# Altium schematic sheet Sheet3.SCHDOC
size 840 x 594 mm; SheetNumber: 3; SheetTotal: 5; DocumentName: Sheet3.SCHDOC
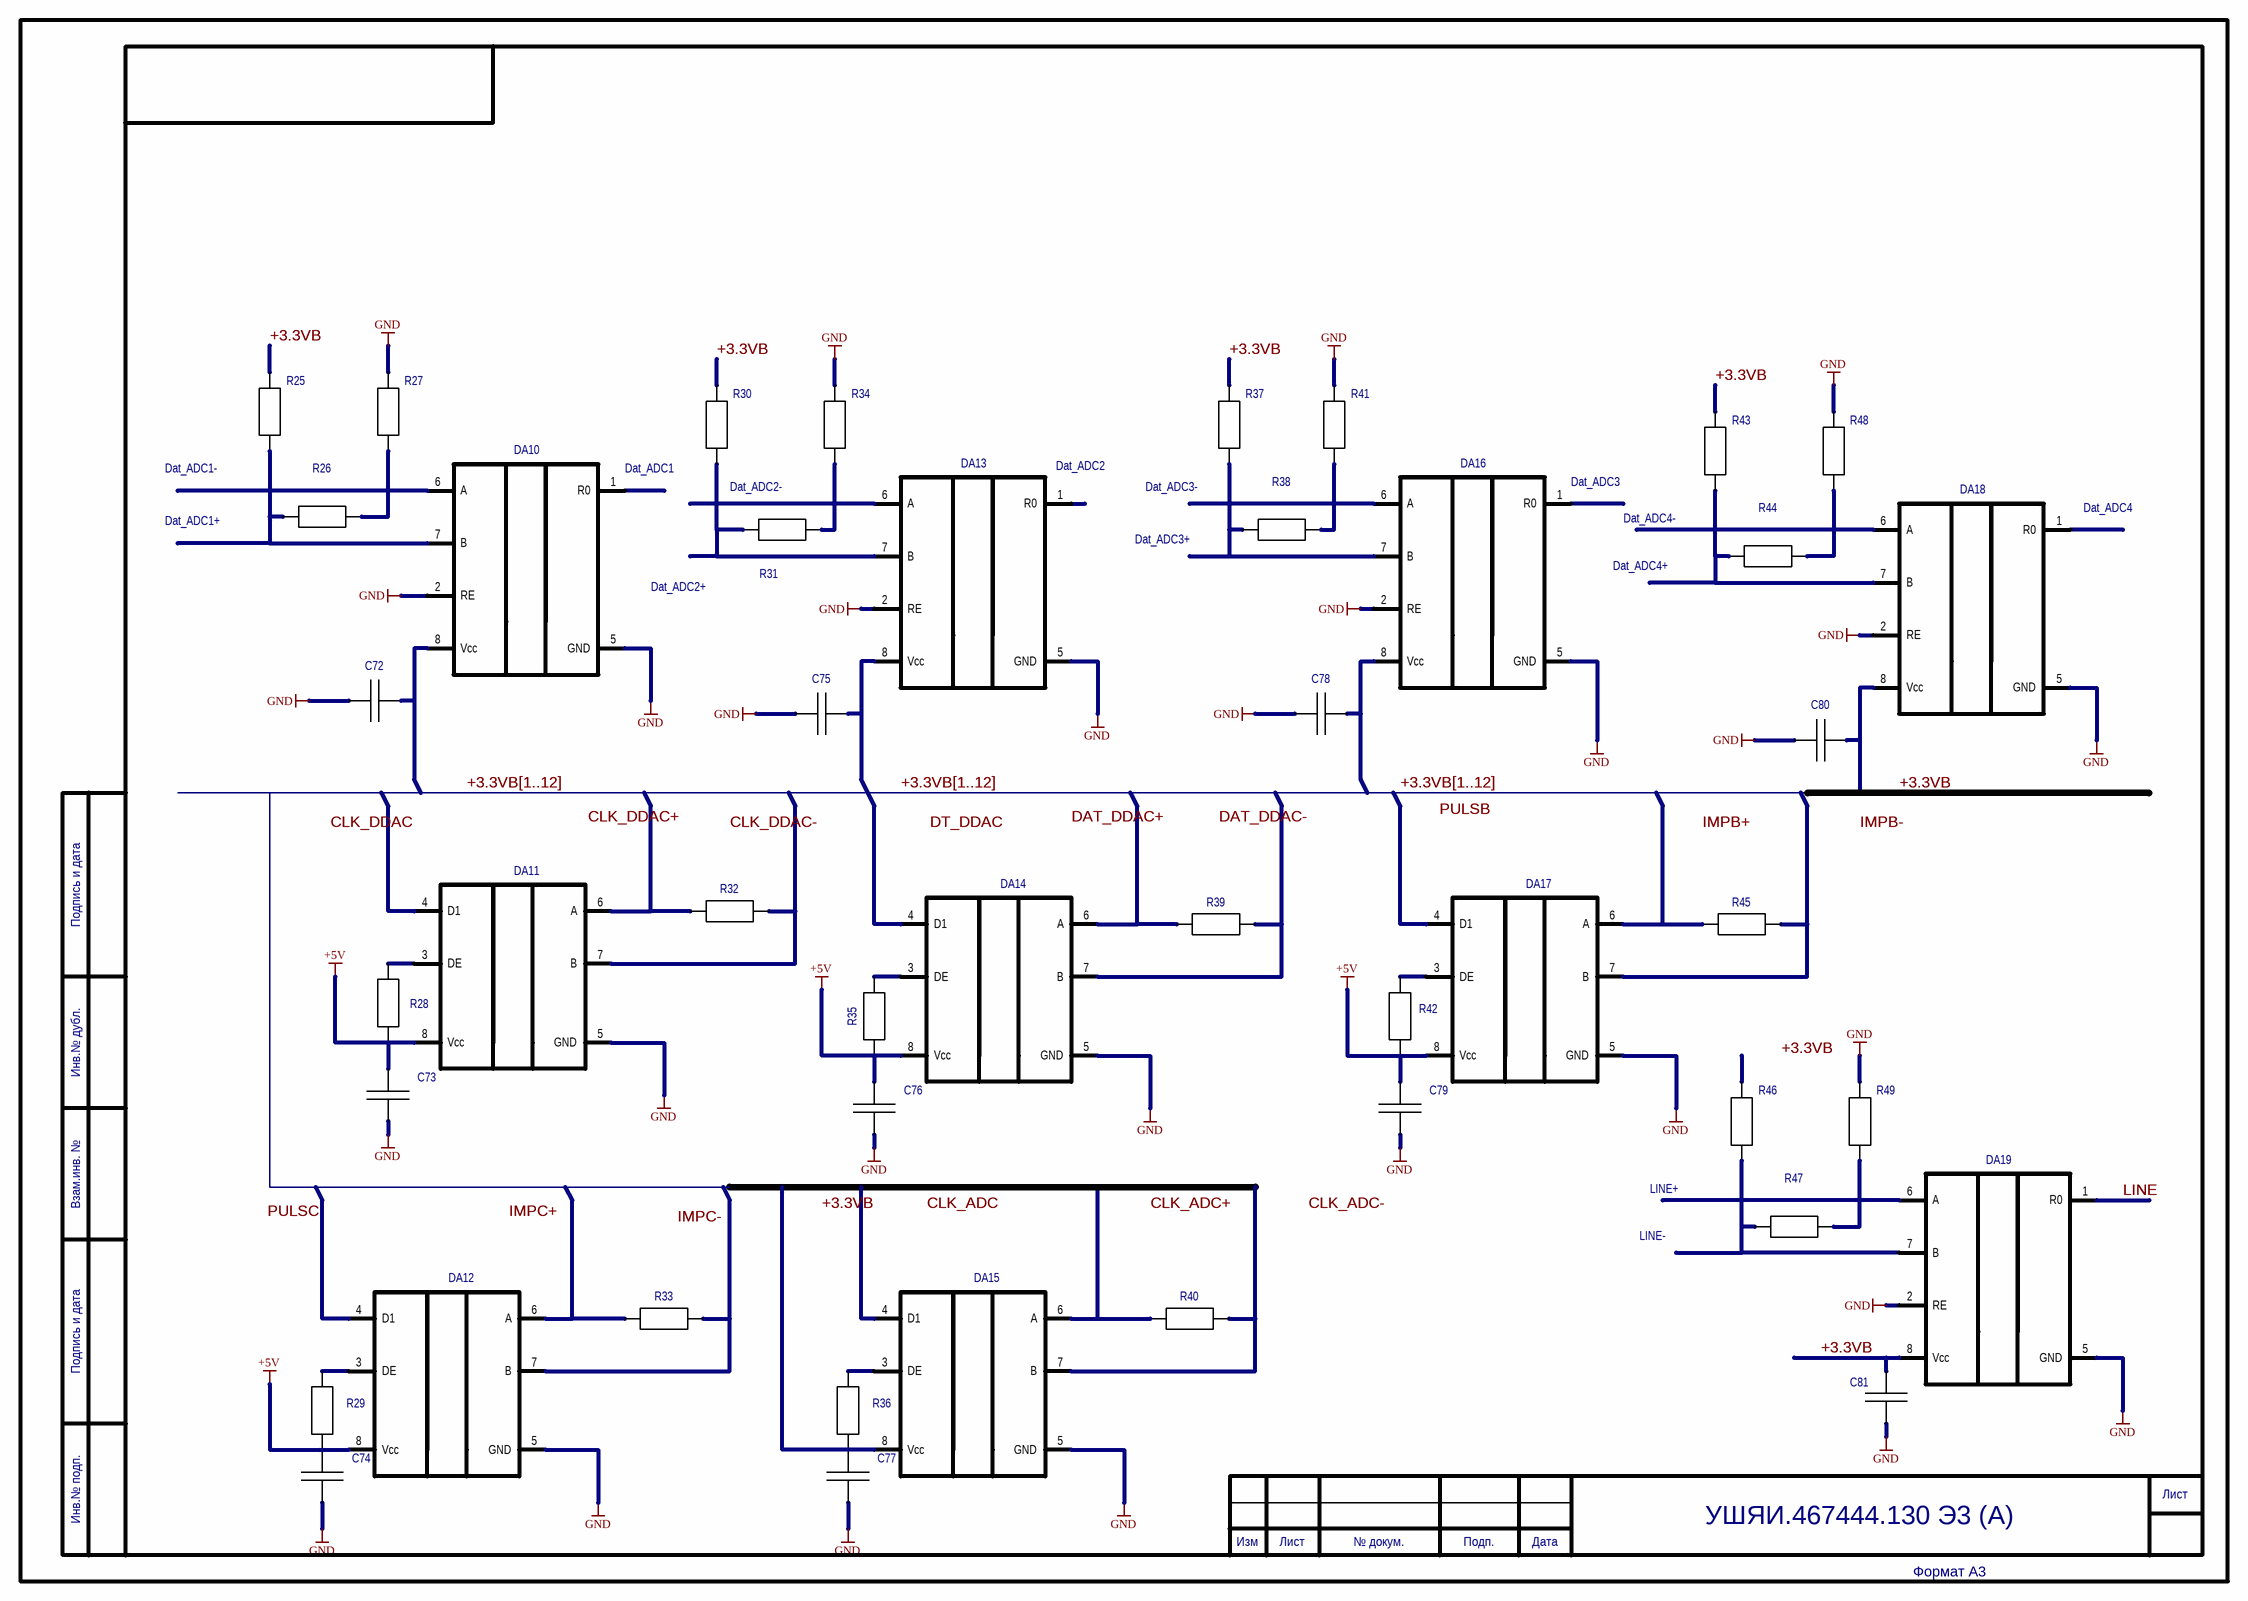
[diagram p0: Sheet3.SCHDOC]

## Parts
C72  GRM21BR71H105K  (value not drawn)
C73  GRM21BR71H104KA01L  (value not drawn)
C74  GRM21BR71H104KA01L  (value not drawn)
C75  GRM21BR71H105K  (value not drawn)
C76  GRM21BR71H104KA01L  (value not drawn)
C77  GRM21BR71H104KA01L  (value not drawn)
C78  GRM21BR71H105K  (value not drawn)
C79  GRM21BR71H104KA01L  (value not drawn)
C80  GRM21BR71H105K  (value not drawn)
C81  GRM21BR71H105K  (value not drawn)
DA10  SN65HVD75  (value not drawn)
DA11  ADM483  (value not drawn)
DA12  ADM483  (value not drawn)
DA13  SN65HVD75  (value not drawn)
DA14  ADM483  (value not drawn)
DA15  SN65HVD75-A  (value not drawn)
DA16  SN65HVD75  (value not drawn)
DA17  ADM483  (value not drawn)
DA18  SN65HVD75  (value not drawn)
DA19  SN65HVD75  (value not drawn)
R25  1206-1 КОМ+-5%  (value not drawn)
R26  1206 - 100 ОМ+-5%  (value not drawn)
R27  1206-1 КОМ+-5%  (value not drawn)
R28  0805-10 KОМ+-5%  [0805]  (value not drawn)
R29  0805-10 KОМ+-5%  [0805]  (value not drawn)
R30  1206-1 КОМ+-5%  (value not drawn)
R31  1206 - 100 ОМ+-5%  (value not drawn)
R32  0805-10 KОМ+-5%  [0805]  (value not drawn)
R33  0805-10 KОМ+-5%  [0805]  (value not drawn)
R34  1206-1 КОМ+-5%  (value not drawn)
R35  0805-10 KОМ+-5%  [0805]  (value not drawn)
R36  0805-10 KОМ+-5%  [0805]  (value not drawn)
R37  1206-1 КОМ+-5%  (value not drawn)
R38  1206 - 100 ОМ+-5%  (value not drawn)
R39  0805-10 KОМ+-5%  [0805]  (value not drawn)
R40  0805-10 KОМ+-5%  [0805]  (value not drawn)
R41  1206-1 КОМ+-5%  (value not drawn)
R42  0805-10 KОМ+-5%  [0805]  (value not drawn)
R43  1206-1 КОМ+-5%  (value not drawn)
R44  1206 - 100 ОМ+-5%  (value not drawn)
R45  0805-10 KОМ+-5%  [0805]  (value not drawn)
R46  1206-1 КОМ+-5%  (value not drawn)
R47  1206 - 100 ОМ+-5%  (value not drawn)
R48  1206-1 КОМ+-5%  (value not drawn)
R49  1206-1 КОМ+-5%  (value not drawn)

## Nets
+5V: C73.2 C74.2 C76.2 C79.2 DA11.8(Vcc) DA12.8(Vcc) DA14.8(Vcc) DA17.8(Vcc) R28.1 R29.1 R35.1 R42.1
GND: C72.1 C73.1 C74.1 C75.1 C76.1 C77.1 C78.1 C79.1 C80.1 C81.1 DA10.2(RE) DA10.5(GND) DA11.5(GND) DA12.5(GND) DA13.2(RE) DA13.5(GND) DA14.5(GND) DA15.5(GND) DA16.2(RE) DA16.5(GND) DA17.5(GND) DA18.2(RE) DA18.5(GND) DA19.2(RE) DA19.5(GND) R27.2 R34.2 R41.2 R48.2 R49.2
+3.3VB: C81.2 DA19.8(Vcc) R25.2 R30.2 R37.2 R43.2
LINE: DA19.1(R0)
NetC72_2: C72.2 DA10.8(Vcc)
NetC75_2: C75.2 DA13.8(Vcc)
NetC77_2: C77.2 DA15.8(Vcc) R36.1
NetC78_2: C78.2 DA16.8(Vcc)
NetC80_2: C80.2 DA18.8(Vcc)
NetDA10_6: DA10.6(A) R26.2 R27.1
NetDA10_7: DA10.7(B) R25.1 R26.1
NetDA11_3: DA11.3(DE) R28.2
NetDA11_6: DA11.6(A) R32.1
NetDA11_7: DA11.7(B) R32.2
NetDA12_3: DA12.3(DE) R29.2
NetDA12_6: DA12.6(A) R33.1
NetDA12_7: DA12.7(B) R33.2
NetDA13_6: DA13.6(A) R31.2 R34.1
NetDA13_7: DA13.7(B) R30.1 R31.1
NetDA14_3: DA14.3(DE) R35.2
NetDA14_6: DA14.6(A) R39.1
NetDA14_7: DA14.7(B) R39.2
NetDA15_3: DA15.3(DE) R36.2
NetDA15_6: DA15.6(A) R40.1
NetDA15_7: DA15.7(B) R40.2
NetDA16_6: DA16.6(A) R38.2 R41.1
NetDA16_7: DA16.7(B) R37.1 R38.1
NetDA17_3: DA17.3(DE) R42.2
NetDA17_6: DA17.6(A) R45.1
NetDA17_7: DA17.7(B) R45.2
NetDA18_6: DA18.6(A) R44.2 R48.1
NetDA18_7: DA18.7(B) R43.1 R44.1
NetDA19_6: DA19.6(A) R47.2 R49.1
NetDA19_7: DA19.7(B) R46.1 R47.1

Not connected (* = marked no-connect by the designer): DA10 1(R0); DA11 4(D1); DA12 4(D1); DA13 1(R0); DA14 4(D1); DA15 4(D1); DA16 1(R0); DA17 4(D1); DA18 1(R0); R46 2

## Buses and harness runs
bus +3.3VB[1..12]

## Notes on the sheet
- (near R25) Dat_ADC1-
- Dat_ADC1
- Dat_ADC2-
- (near DA13) Dat_ADC2
- Dat_ADC3-
- (near DA16) Dat_ADC3
- (near DA18) Dat_ADC4
- Dat_ADC1+
- Dat_ADC3+
- Dat_ADC4+
- Dat_ADC4-
- Dat_ADC2+
- Подпись и дата
- Инв.№ дубл.
- Взам.инв. №
- LINE-
- LINE+
- Инв.№ подп.
- УШЯИ.467444.130 Э3 (A)
- Лист
- Изм
- № докум.
- Подп.
- Дата
- Формат А3
- Подп. дата
- Инв. № дубл.
- Взам. инв. №
- Подп. и дата
- Инв. № подл.
- Изм.
- ALTIUM GOSTBOM2.0 KEV
- Файл:
- Копировал

## Library data of the parts
C72 C75 C78 C80 C81 = GRM21BR71H105K: Name2: Конденсатор GRM21BR71H105K; Name1: Конденсатор GRM21BR71H105K Murata; Value: *
C73 C74 C76 C77 C79 = GRM21BR71H104KA01L: Name2: Конденсатор GRM21BR71H104KA01L; Value: *; Name1: Конденсатор GRM21BR71H104KA01L
DA10 DA13 DA16 DA18 DA19 = SN65HVD75: Standart: Analog Devices; Name2: ADM483AR; Value: *; Name1: ADM483AR
DA11 DA12 DA14 DA17 = ADM483: Standart: Analog Devices; Name2: ADM483AR; Value: *; Name1: ADM483AR
DA15 = SN65HVD75-A: Name1: ADM483AR; Standart: Analog Devices; Value: *; Name2: ADM483AR
R25 R27 R30 R34 R37 R41 R43 R46 R48 R49 = 1206-1 КОМ+-5%: Name1: Резистор 1206-1 кОм+-5%; Value: *; Name2: Резистор 1206-1 кОм+-5%
R26 R31 R38 R44 R47 = 1206 - 100 ОМ+-5%: Name2: Резистор 1206 - 100 Ом+-5%; Value: *; Name1: Резистор 1206 - 100 Ом+-5%
R28 R29 R32 R33 R35 R36 R39 R40 R42 R45 = 0805-10 KОМ+-5%: Name1: Резистор 0805-10 кОм+-5%; Name2: Резистор 0805-10 кОм+-5%